# EAGLE schematic LED-Lampe Power  ZXLD1362 (EAGLE 6.2)
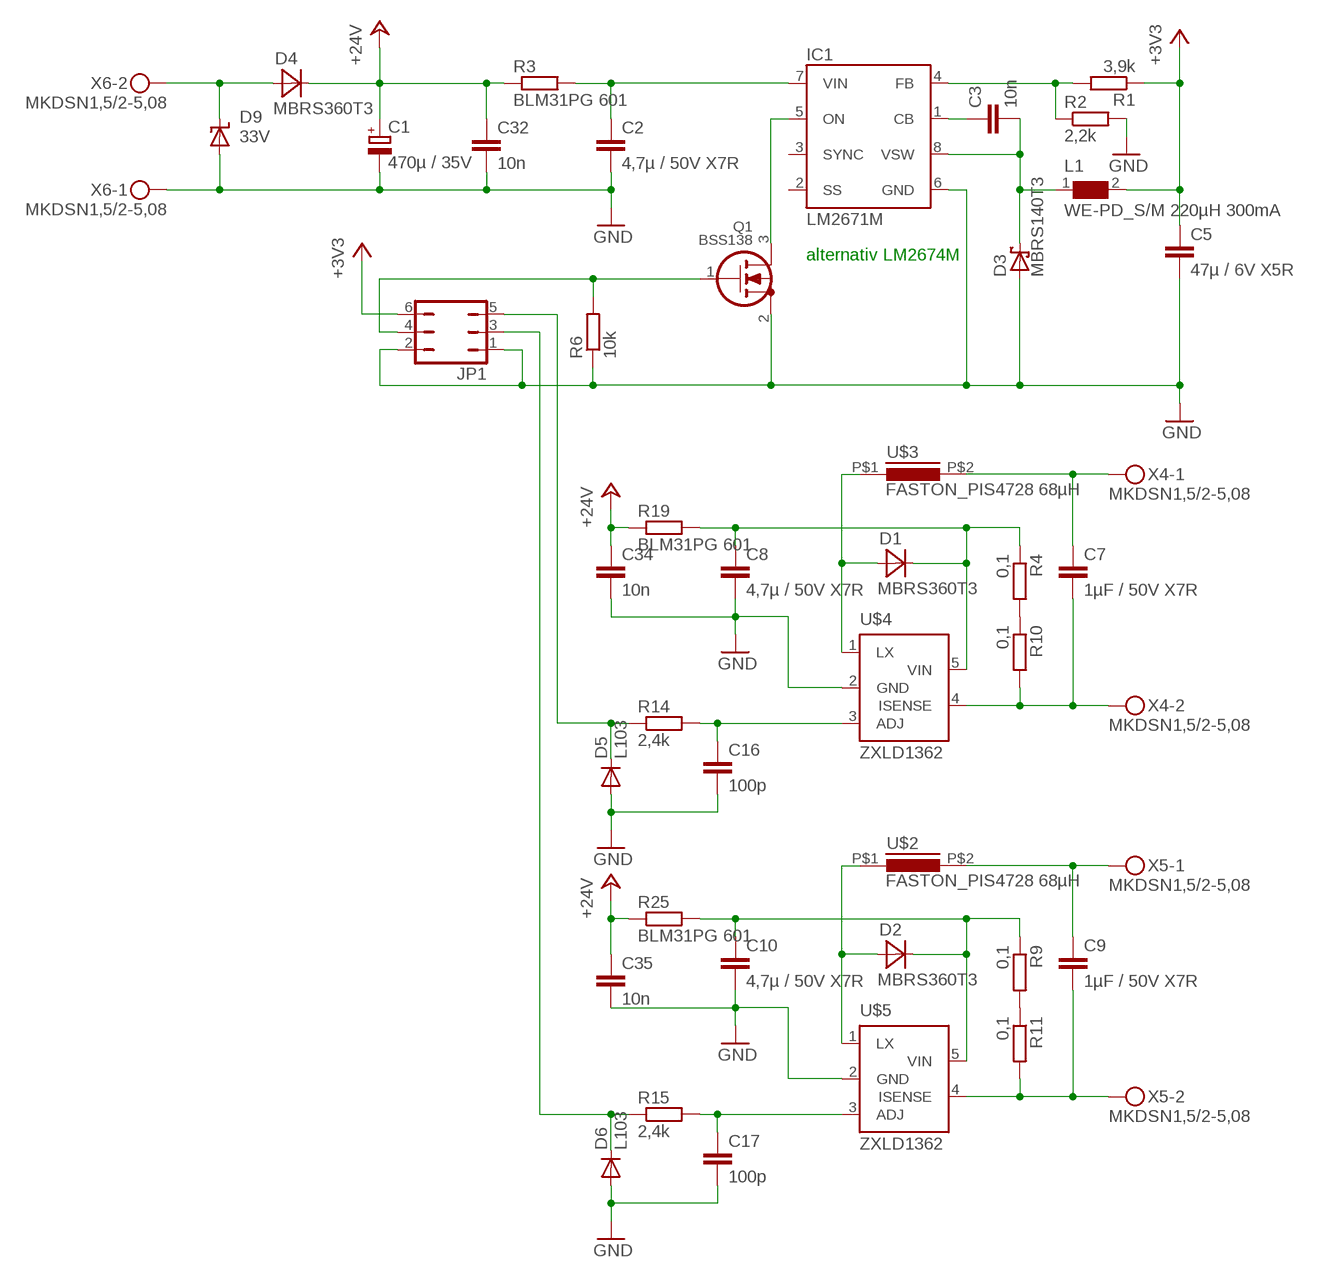
[diagram p0: schematic, sheet 1]

## Parts
C1  470µ / 35V  CPOL-EUE5-13  [E5-13]
C2  4,7µ / 50V X7R  C-EUC1206  [C1206]
C3  10n  C-EUC1206  [C1206]
C5  47µ / 6V X5R  C-EUC1206  [C1206]
C7  1µF / 50V X7R  C-EUC1206  [C1206]
C8  4,7µ / 50V X7R  C-EUC1206  [C1206]
C9  1µF / 50V X7R  C-EUC1206  [C1206]
C10  4,7µ / 50V X7R  C-EUC1206  [C1206]
C16  100p  C-EUC0603  [C0603]
C17  100p  C-EUC0603  [C0603]
C32  10n  C-EUC1206  [C1206]
C34  10n  C-EUC1206  [C1206]
C35  10n  C-EUC1206  [C1206]
D1  MBRS360T3  [SMC]
D2  MBRS360T3  [SMC]
D3  MBRS140T3  SCHOTTKY-DIODESMD  [SMB]
D4  MBRS360T3  [SMC]
D5  L103  DIODE-SOD123  [SOD123]
D6  L103  DIODE-SOD123  [SOD123]
D9  33V  SUPPRESSOR-SMBJ  [SMBJ]
IC1  LM2671M  [SO08]
JP1  JP3Q  [JP3Q]
L1  WE-PD_S/M 220µH 300mA  WE-PD_S/M  [WE-PD_S/M]
Q1  BSS138  [SOT23]
R1  3,9k  R-EU_R1206  [R1206]
R2  2,2k  R-EU_R1206  [R1206]
R3  BLM31PG 601  R-EU_R1206  [R1206@1]
R4  0,1  R-EU_R1206  [R1206@1]
R6  10k  R-EU_R1206  [R1206]
R9  0,1  R-EU_R1206  [R1206@1]
R10  0,1  R-EU_R1206  [R1206@1]
R11  0,1  R-EU_R1206  [R1206@1]
R14  2,4k  R-EU_R1206  [R1206]
R15  2,4k  R-EU_R1206  [R1206]
R19  BLM31PG 601  R-EU_R1206  [R1206@1]
R25  BLM31PG 601  R-EU_R1206  [R1206@1]
U$2  FASTON_PIS4728 68µH  FASTON_PIS4728  [FASTON_PIS4728]
U$3  FASTON_PIS4728 68µH  FASTON_PIS4728  [FASTON_PIS4728]
U$4  ZXLD1362  [SOT23-5]
U$5  ZXLD1362  [SOT23-5]
X4  MKDSN1,5/2-5,08  [MKDSN1,5/2-5,08]
X5  MKDSN1,5/2-5,08  [MKDSN1,5/2-5,08]
X6  MKDSN1,5/2-5,08  [MKDSN1,5/2-5,08]

## Nets
+3V3: C5.1 JP1.6 L1.2 R1.1
+24V: C1.+ C32.1 C34.1 C35.1 D4.C R3.1 R19.1 R25.1
GND: C1.- C2.2 C5.2 C8.2 C10.2 C16.2 C17.2 C32.2 C34.2 C35.2 D3.A D5.A D6.A D9.A IC1.6(GND) JP1.1 JP1.2 Q1.2(S) R2.2 R6.1 U$4.2(GND) U$5.2(GND) X6.1
N$1: C2.1 IC1.7(VIN) R3.2
N$3: C3.1 IC1.1(CB)
N$4: IC1.4(FB) R1.2 R2.1
N$5: C3.2 D3.C IC1.8(VSW) L1.1
N$6: JP1.4 Q1.1(G) R6.2
N$7: R4.2 R10.1
N$8: R9.2 R11.1
N$9: D4.A D9.C X6.2
N$10: C16.1 R14.2 U$4.3(ADJ)
N$11: IC1.5(ON) Q1.3(D)
N$13: C17.1 R15.2 U$5.3(ADJ)
N$28: D1.A U$3.P$1 U$4.1(LX)
N$29: C7.1 U$3.P$2 X4.1
N$30: C7.2 R10.2 U$4.4(ISENSE) X4.2
N$33: D2.A U$2.P$1 U$5.1(LX)
N$34: C9.1 U$2.P$2 X5.1
N$35: C9.2 R11.2 U$5.4(ISENSE) X5.2
N$47: C8.1 D1.C R4.1 R19.2 U$4.5(VIN)
N$48: C10.1 D2.C R9.1 R25.2 U$5.5(VIN)
P1.6: D6.C JP1.3 R15.1
P1.7: D5.C JP1.5 R14.1
Unconnected: IC1.2(SS) IC1.3(SYNC)

## Notes on the sheet
- alternativ LM2674M

## Library data of the parts
C1 = rcl:CPOL-EU: POLARIZED CAPACITOR, European symbol
C2 C5 C7-C10 = resistor:C-EU: CAPACITOR, European symbol
C3 C16 C17 C32 C34 C35 = rcl:C-EU: CAPACITOR, European symbol
D1 D2 D4 = diode:MBRS360T3: Surface Mount Schottky Power Rectifier Source: http://www.onsemi.com/pub_link/Collateral/MBRA340T3-D.PDF
D3 = diode:SCHOTTKY-DIODE: Schottky Diode
D5 D6 = diode:DIODE-: DIODE
D9 = diode:SUPPRESSOR-: Suppressor diode
IC1 = v-reg-3:LM2671: National Semiconductor <http://www.national.com> 0.5A "Simple Switcher"(c) 260kHz, Vout 1.2-37V, Vin 40V, 250mOhm DMOS switch, 50µA standby current, optional sync. to 280-400kHz, soft start
JP1 = jumper:JP3Q: JUMPER
L1 = wuerth_elektronik_eisos__v6.8_20100429:WE-PD: SMD-Shielded Power Inductors WE-PD - Magnetically shielded version which results in a low leakage field - High storage capacity - Low self-losses - Highest possible current loading for SMD-Inducors -- Switching regulators with low operating voltages (computer, laptop, mobile phones, pagers) -- Integrated DC/DC-converter -- Is recommended for the application with switching regulators from National Semiconductor, Linear Technology, Texas Instruments and Fairchild Semiconductor, ect. -- Graphic cards -- Plastic base: Because of the one piece construction these are more suitable for high vibration or shock applications
Q1 = transistors:BSS138: BSS138: N-channel enhancement MOSFET (ON Semiconductor) 50V Uds, 200mA Id, 225mW Ptot, 3.5Ω Rdson
R1 R2 R6 R14 R15 = rcl:R-EU_: RESISTOR, European symbol
R3 R4 R9-R11 R19 R25 = resistor:R-EU_: RESISTOR, European symbol
U$2 U$3 = LED-Treiber:FASTON_PIS4728: Schaltregler Induktivität
U$4 U$5 = zetex1:ZXLD1362: ZXLD1350 350mA LED driver with internal switch
X4-X6 = con-phoenix-508:MKDSN1,5/2-5,08: MKDSN 1,5/ 2-5,08 Printklemme Nennstrom: 13,5 A Nennspannung: 250 V Rastermaß: 5,08 mm Polzahl: 2 Anschlussart: Schraubanschluss Montage: Löten Anschlussrichtung Leiter/Platine: 0 ° Artikelnummer: 1729128 Source: http://eshop.phoenixcontact.com .. 1729128.pdf; MPN: MKDSN 1,5/2-5.08; OC_FARNELL: 1792903; OC_NEWARK: 30M2397